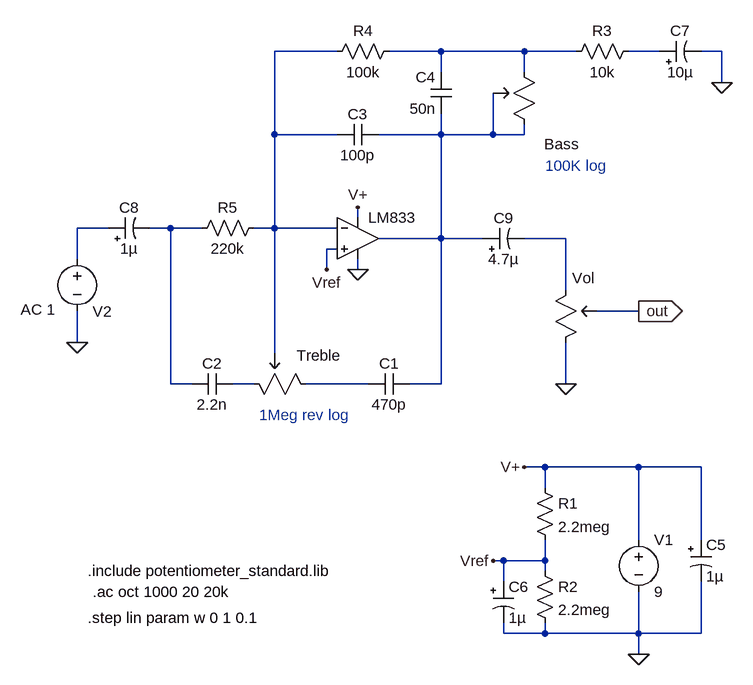
[diagram p0: schematic funky_dude_2eq_v1.asc]
funky_dude_2eq_v1.asc, the LTspice schematic file:
Version 4
SHEET 1 1644 972
WIRE -416 -224 -512 -224
WIRE -256 -224 -336 -224
WIRE -128 -224 -256 -224
WIRE -48 -224 -128 -224
WIRE 80 -224 32 -224
WIRE 176 -224 144 -224
WIRE -256 -192 -256 -224
WIRE -128 -192 -128 -224
WIRE 176 -176 176 -224
WIRE -512 -96 -512 -224
WIRE -416 -96 -512 -96
WIRE -256 -96 -256 -128
WIRE -256 -96 -352 -96
WIRE -176 -96 -176 -160
WIRE -176 -96 -256 -96
WIRE -128 -96 -128 -112
WIRE -128 -96 -176 -96
WIRE -384 32 -384 16
WIRE -768 48 -816 48
WIRE -672 48 -704 48
WIRE -624 48 -672 48
WIRE -512 48 -512 -96
WIRE -512 48 -544 48
WIRE -416 48 -512 48
WIRE -256 64 -256 -96
WIRE -256 64 -352 64
WIRE -192 64 -256 64
WIRE -64 64 -128 64
WIRE -416 80 -432 80
WIRE -816 96 -816 48
WIRE -432 112 -432 80
WIRE -384 112 -384 96
WIRE -64 144 -64 64
WIRE 48 176 -16 176
WIRE -816 224 -816 176
WIRE -512 240 -512 48
WIRE -672 288 -672 48
WIRE -640 288 -672 288
WIRE -544 288 -576 288
WIRE -368 288 -464 288
WIRE -256 288 -256 64
WIRE -256 288 -304 288
WIRE -64 288 -64 224
WIRE -96 416 -128 416
WIRE 48 416 -96 416
WIRE 144 416 48 416
WIRE -96 448 -96 416
WIRE 48 528 48 416
WIRE 144 528 144 416
WIRE -160 560 -176 560
WIRE -96 560 -96 528
WIRE -96 560 -160 560
WIRE -96 576 -96 560
WIRE -160 592 -160 560
WIRE -160 672 -160 656
WIRE -96 672 -96 656
WIRE -96 672 -160 672
WIRE 48 672 48 608
WIRE 48 672 -96 672
WIRE 144 672 144 592
WIRE 144 672 48 672
WIRE 48 704 48 672
FLAG -64 288 0
FLAG 48 176 out
IOPIN 48 176 Out
FLAG -128 416 V+
FLAG -176 560 Vref
FLAG -432 112 Vref
FLAG -384 16 V+
FLAG -384 112 0
FLAG 48 704 0
FLAG -816 224 0
FLAG 176 -176 0
SYMBOL res -112 432 R0
SYMATTR InstName R1
SYMATTR Value 2.2meg
SYMBOL res -112 560 R0
SYMATTR InstName R2
SYMATTR Value 2.2meg
SYMBOL res -64 -208 R270
WINDOW 0 32 56 VTop 2
WINDOW 3 0 56 VBottom 2
SYMATTR InstName R3
SYMATTR Value 10k
SYMBOL res -432 -208 R270
WINDOW 0 32 56 VTop 2
WINDOW 3 0 56 VBottom 2
SYMATTR InstName R4
SYMATTR Value 100k
SYMBOL res -640 64 R270
WINDOW 0 32 56 VTop 2
WINDOW 3 0 56 VBottom 2
SYMATTR InstName R5
SYMATTR Value 220k
SYMBOL cap -304 272 R90
WINDOW 0 0 32 VBottom 2
WINDOW 3 32 32 VTop 2
SYMATTR InstName C1
SYMATTR Value 470p
SYMBOL cap -576 272 R90
WINDOW 0 0 32 VBottom 2
WINDOW 3 32 32 VTop 2
SYMATTR InstName C2
SYMATTR Value 2.2n
SYMBOL cap -352 -112 R90
WINDOW 0 0 32 VBottom 2
WINDOW 3 32 32 VTop 2
SYMATTR InstName C3
SYMATTR Value 100p
SYMBOL cap -240 -128 R180
WINDOW 0 24 56 Left 2
WINDOW 3 24 8 Left 2
SYMATTR InstName C4
SYMATTR Value 50n
SYMBOL polcap 128 528 R0
SYMATTR InstName C5
SYMATTR Value 1µ
SYMBOL polcap -176 592 R0
SYMATTR InstName C6
SYMATTR Value 1µ
SYMBOL polcap 80 -208 R270
WINDOW 0 32 32 VTop 2
WINDOW 3 0 32 VBottom 2
SYMATTR InstName C7
SYMATTR Value 10µ
SYMBOL polcap -768 64 R270
WINDOW 0 32 32 VTop 2
WINDOW 3 0 32 VBottom 2
SYMATTR InstName C8
SYMATTR Value 1µ
SYMBOL polcap -192 80 R270
WINDOW 0 32 32 VTop 2
WINDOW 3 0 32 VBottom 2
SYMATTR InstName C9
SYMATTR Value 4.7µ
SYMBOL voltage 48 512 R0
WINDOW 123 0 0 Left 2
WINDOW 39 0 0 Left 2
SYMATTR InstName V1
SYMATTR Value 9
SYMBOL voltage -816 80 R0
WINDOW 0 39 81 Top 2
WINDOW 3 -88 56 VBottom 2
WINDOW 123 -60 109 Bottom 2
WINDOW 39 0 0 Left 2
SYMATTR InstName V2
SYMATTR Value ""
SYMATTR Value2 AC 1
SYMBOL potentiometer_standard -112 -96 R180
WINDOW 39 48 112 Invisible 2
WINDOW 38 48 41 Invisible 2
WINDOW 0 -68 -15 Left 2
WINDOW 3 -243 26 Invisible 2
SYMATTR SpiceLine Rtap=12k tap=0.5
SYMATTR SpiceModel pot_plog
SYMATTR InstName Bass
SYMATTR Value Rtot=100K wiper={w}
SYMBOL potentiometer_standard -448 304 M270
WINDOW 38 48 41 Invisible 2
WINDOW 39 48 112 Invisible 2
WINDOW 0 60 30 VLeft 2
WINDOW 3 -22 212 Invisible 2
SYMATTR SpiceModel pot_nlog
SYMATTR SpiceLine Rtap=140k tap=0.5
SYMATTR InstName Treble
SYMATTR Value Rtot=1000K wiper={w}
SYMBOL Opamps\\UniversalOpamp2 -384 64 R0
SYMATTR InstName LM833
SYMBOL potentiometer_standard -80 240 M180
WINDOW 38 48 41 Invisible 2
WINDOW 39 48 112 Invisible 2
WINDOW 0 26 115 Left 2
WINDOW 3 30 1 Invisible 2
SYMATTR SpiceModel pot_nlog
SYMATTR SpiceLine Rtap=2k tap=0.5
SYMATTR InstName Vol
SYMATTR Value Rtot=25K wiper=1
TEXT -792 608 Left 2 !.ac oct 1000 20 20k
TEXT -800 576 Left 2 !.include potentiometer_standard.lib
TEXT -800 648 Left 2 !.step lin param w 0 1 0.1
TEXT -96 -48 Left 2 ;100K log
TEXT -536 336 Left 2 ;1Meg rev log

The netlist it stands for:
* funky_dude_2eq_v1.asc
R1 V+ Vref 2.2meg
R2 Vref 0 2.2meg
R3 N002 N003 10k
R4 N001 N002 100k
R5 N006 N001 220k
C1 N004 N009 470p
C2 N008 N006 2.2n
C3 N004 N001 100p
C4 N004 N002 50n
C5 V+ 0 1µ
C6 Vref 0 1µ
C7 N003 0 10µ
C8 N005 N006 1µ
C9 N004 N007 4.7µ
V1 V+ 0 9
V2 N005 0 AC 1
XBass N004 N002 N004 pot_plog Rtot=100K wiper={w} Rtap=12k tap=0.5  ; pins A B C
XTreble N009 N008 N001 pot_nlog Rtot=1000K wiper={w} Rtap=140k tap=0.5  ; pins A B C
XLM833 Vref N001 V+ 0 N004 level.2 Avol=1Meg GBW=10Meg Slew=10Meg ilimit=25m rail=0 Vos=0 phimargin=45 en=0 enk=0 in=0 ink=0 Rin=500Meg  ; pins IN+ IN- V+ V- OUT
XVol 0 N007 out pot_nlog Rtot=25K wiper=1 Rtap=2k tap=0.5  ; pins A B C
.ac oct 1000 20 20k
.include potentiometer_standard.lib
.step lin param w 0 1 0.1
* 100K log
* 1Meg rev log
.lib UniversalOpamps2.sub
.backanno
.end